# Altium schematic sheet P01_crispDemo.SchDoc
size A3
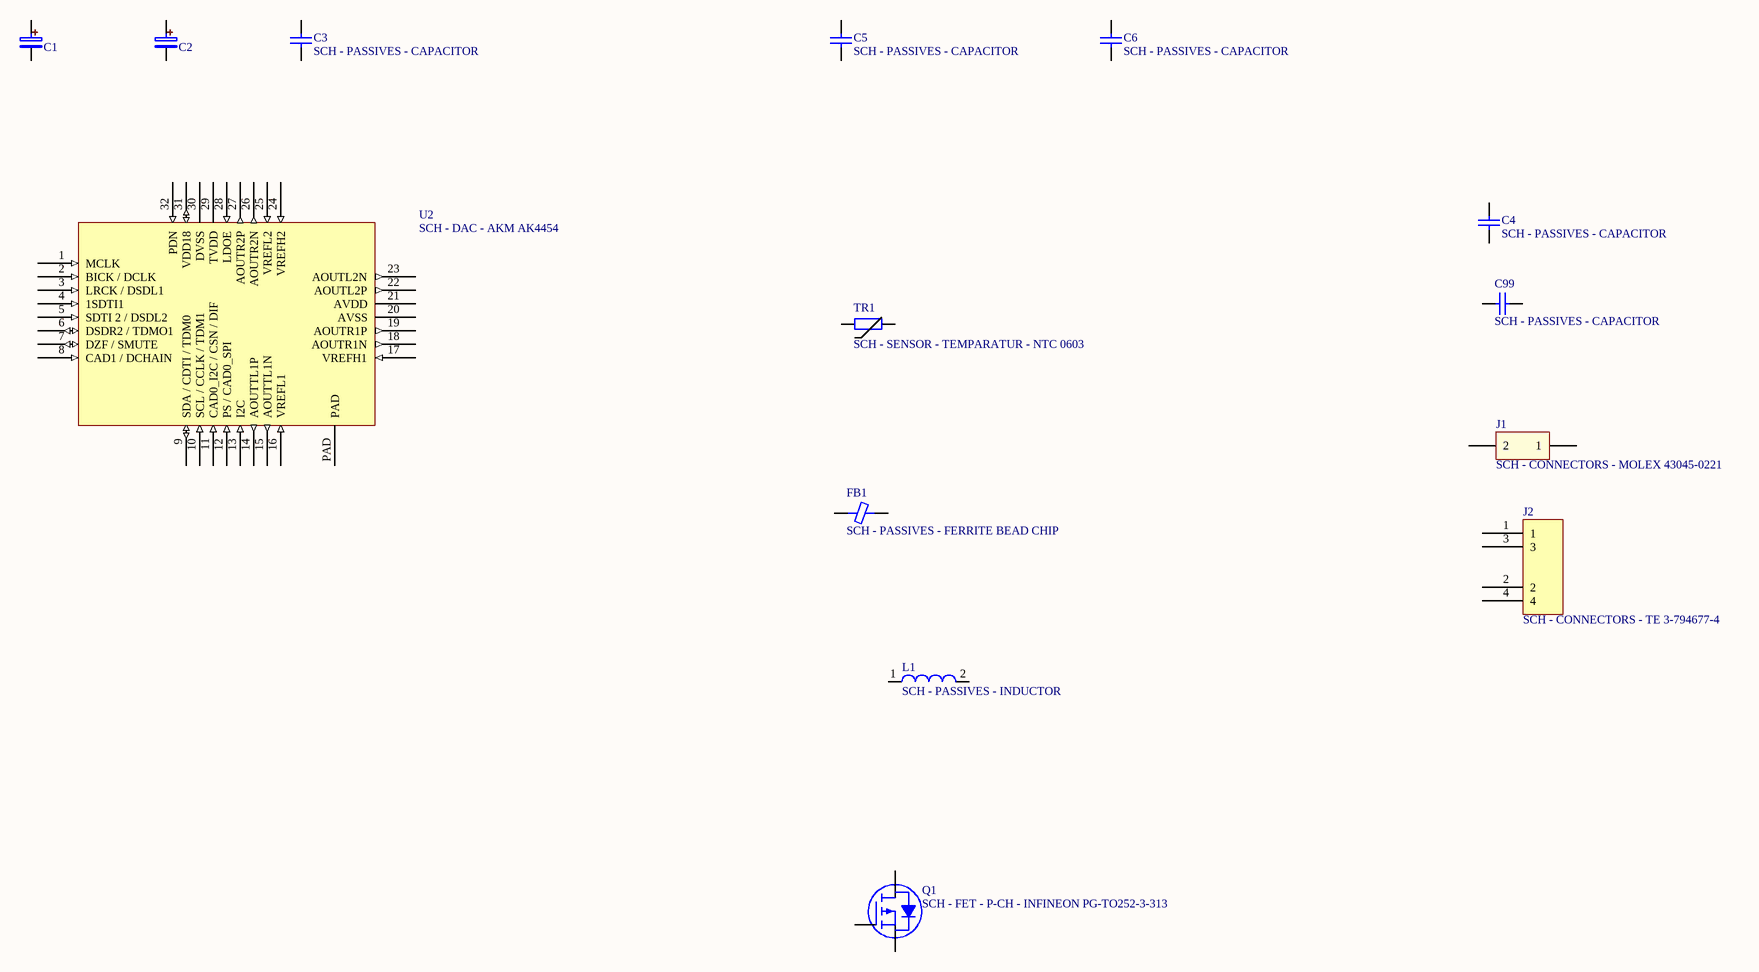
[diagram p0: P01_crispDemo.SchDoc]

## Parts
C1  SCH - PASSIVES - POLARISED CAPACITOR  [PCB - Capacitors - ELCO - Nichicon UKA1E472MHD]  (value not drawn)
C2  SCH - PASSIVES - POLARISED CAPACITOR  [PCB - Capacitors - ELCO - Nichicon UKA1E472MHD]  (value not drawn)
C3  SCH - PASSIVES - CAPACITOR  [PCB - CAPACITOR - MLCC - CAP 0402_1005]
C4  SCH - PASSIVES - CAPACITOR  [PCB - CAPACITOR - MLCC - CAP 0603_1608]
C5  SCH - PASSIVES - CAPACITOR  [PCB - CAPACITOR - MLCC - CAP 0805_2012]
C6  SCH - PASSIVES - CAPACITOR  [PCB - CAPACITOR - MLCC - CAP 1206_3216]
C99  SCH - PASSIVES - CAPACITOR  [PCB - CAPACITOR - MLCC - CAP 0603_1608]
FB1  SCH - PASSIVES - FERRITE BEAD CHIP  [PCB - Passiv - Ferrit Bead Chip - 0402]
J1  SCH - CONNECTORS - MOLEX 43045-0221  [PCB - CONNECTORS - MOLEX 43045-0221]
J2  SCH - CONNECTORS - TE 3-794677-4  [PCB - CONNECTORS - TE 3-794677-4]
L1  SCH - PASSIVES - INDUCTOR  [PCB - PASSIV - IND - WE-TPC 2828]
Q1  SCH - FET - P-CH - INFINEON PG-TO252-3-313  [PCB - Leaded - DPAK - Infineon PG-TO252-3]
TR1  SCH - SENSOR - TEMPARATUR - NTC 0603  [PCB- SENSOR - TEMPARATUR - NTC 0603]
U2  SCH - DAC - AKM AK4454  [PCB - DAC - AKM QFN32]

## Nets

Not connected (* = marked no-connect by the designer): C1 1(+) 2(-); C2 1(+) 2(-); C3 1 2; C4 1 2; C5 1 2; C6 1 2; C99 1 2; FB1 1 2; J1 1 2; J2 1 2 3 4; L1 1 2; Q1 1(G) 2(D) 3(S); TR1 1 2; U2 1(MCLK) 2(BICK_/_DCLK) 3(LRCK_/_DSDL1) 4(1SDTI1) 5(SDTI_2_/_DSDL2) 6(DSDR2_/_TDMO1) 7(DZF_/_SMUTE) 8(CAD1_/_DCHAIN) 9(SDA_/_CDTI_/_TDM0) 10(SCL_/_CCLK_/_TDM1) 11(CAD0_I2C_/_CSN_/_DIF) 12(PS_/_CAD0_SPI) 13(I2C) 14(AOUTTL1P) 15(AOUTTL1N) 16(VREFL1) 17(VREFH1) 18(AOUTR1N) 19(AOUTR1P) 20(AVSS) 21(AVDD) 22(AOUTL2P) 23(AOUTL2N) 24(VREFH2) 25(VREFL2) 26(AOUTR2N) 27(AOUTR2P) 28(LDOE) 29(TVDD) 30(DVSS) 31(VDD18) 32(PDN) PAD

## Notes on the sheet
- Title:
- Size:
- Date:
- A3
- Variant:
- Time:
- Revision:
- Sheet
- of
- File:

## Library data of the parts
C1 = EKYA630ELL152MLP1S: 1500 µF 63 V Aluminum Electrolytic Capacitors Radial, Can 10000 Hrs @ 105°C; Manufacturer: Chemi-Con; Rated Capacitance: 1500uF; Ratings: NA; Capacitance Tolerance: +-20% at 120Hz, 20°c; Rated Voltage: 63V; Ripple Current @ Low Frequency: 1.74 A @ 120 Hz; Ripple Current @ High Frequency: 2.9 A @ 100 kHz; Part Number: EKYA630ELL152MLP1S; Verified: No; Package: Radial, Can; Part Status: Active; Operating Temperature: -40°C ~ 105°C; Lifetime @ Temperature: 10000 Hrs @ 105°C; Lead Spacing: 7.50mm; Mounting Type: Through Hole; Height - Seated (Max): 36.50mm; Size / Dimension: Dia 16.00mm
C2 = UKA1E472MHD: CAP ALUM 4700UF 20% 25V RADIAL; Manufacturer: Nichicon; Ratings: AEC-Q200 compliant; Capacitance Tolerance: +-20% at 120Hz, 20°c; Lifetime @ Temperature: 2000 Hrs @ 105°C; Ripple Current @ Low Frequency: 1.71 A @ 120 Hz; Ripple Current @ High Frequency: 1.9665 A @ 10 kHz; Part Number: UKA1E472MHD; Rated Capacitance: 4700uF; Verified: No; Package: Radial, Can; Part Status: Not For New Designs; Rated Voltage: 25V; Operating Temperature: -55°C ~ 105°C; Lead Spacing: 7.50mm; Mounting Type: Through Hole; Height - Seated (Max): 33.00mm; Size / Dimension: Dia 16.00mm
C3 = CL05B104KA5NNNC: CAP CER 0.1UF 25V X7R 0402; Manufacturer: Samsung Electro-Mechanics; Ratings: NA; Tolerance: +-10%; Part Number: CL05B104KA5NNNC; Capacitance: 0.1uF; Verified: No; Package: 0402 (1005 Metric); Part Status: Active; Temperature Coefficient: X7R; Voltage - Rated: 25V; Operating Temperature: -55°C ~ 125°C; Size / Dimension: 0.039" L x 0.020" W (1.00mm x 0.50mm); Thickness (Max): 0.022" (0.55mm); Features: NA
C4 C99 = CGA3E2X7R1H104K080AE: CAP CER 0.1UF 50V X7R 0603; Manufacturer: TDK Corporation; Tolerance: +-10%; Part Number: CGA3E2X7R1H104K080AE; Capacitance: 0.1uF; Verified: No; Package: 0603 (1608 Metric); Part Status: Active; Ratings: AEC-Q200; Temperature Coefficient: X7R; Voltage - Rated: 50V; Operating Temperature: -55°C ~ 125°C; Size / Dimension: 0.063" L x 0.031" W (1.60mm x 0.80mm); Thickness (Max): 0.037" (0.95mm); Features: Soft Termination
C5 = GCJ21BR71H105KA01L: CAP CER 1UF 50V X7R 0805; Manufacturer: Murata Electronics; Tolerance: +-10%; Part Number: GCJ21BR71H105KA01L; Capacitance: 1uF; Verified: No; Package: 0805 (2012 Metric); Part Status: Active; Ratings: AEC-Q200; Temperature Coefficient: X7R; Voltage - Rated: 50V; Operating Temperature: -55°C ~ 125°C; Size / Dimension: 0.079" L x 0.049" W (2.00mm x 1.25mm); Thickness (Max): 0.057" (1.45mm); Features: Soft Termination
C6 = GCJ31CR71H225KA12K: CAP CER 2.2UF 50V X7R 1206; Manufacturer: Murata Electronics; Capacitance: 2.2 µF; Tolerance: +-10%; Part Number: GCJ31CR71H225KA12K; Verified: No; Package: 1206 (3216 Metric); Part Status: Active; Ratings: AEC-Q200; Temperature Coefficient: X7R; Voltage - Rated: 50V; Operating Temperature: -55°C ~ 125°C; Size / Dimension: 0.126" L x 0.063" W (3.20mm x 1.60mm); Thickness (Max): 0.075" (1.90mm); Features: Soft Termination
FB1 = BLM15AG221SH1D: FERRITE BEAD 220 OHM 0402 1LN; Manufacturer: Murata Electronics; Impedance @ Frequency: 220 Ohms @ 100 MHz; Current Rating (Max): 300mA; DC Resistance (DCR) (Max): 350mOhm; Part Number: BLM15AG221SH1D; Verified: No; Package: 0402 (1005 Metric); Part Status: Active; Ratings: AEC-Q200; Operating Temperature: -55°C ~ 125°C; Mounting Type: Surface Mount; Height (Max): 0.022" (0.55mm); Size / Dimension: 0.039" L x 0.022" W (1.00mm x 0.55mm); Series: EMIFIL®, BLM15
J1 = 0430450221: CONN HEADER R/A 2POS; Number of Positions: 2; Row Spacing - Mating: 0.118" (3.00mm); Style: Board to Cable/Wire; Current Rating (Amps): 8A; Voltage Rating: 600V; Series: Micro-Fit 3.0 43045; Verified: No; Connector Type: Header; Manufacturer: Molex; Part Number: 0430450221; Part Status: Active; Contact Type: Male Pin; Number of Rows: 2; Mounting Type: Through Hole, Right Angle; Termination: Solder; Fastening Type: Locking Ramp; Insulation Color: Black
J2 = 3-794677-4: CONN HEADER R/A 4POS 3MM; Manufacturer: TE Connectivity AMP Connectors; Number of Positions: 4; Row Spacing - Mating: 0.118" (3.00mm); Style: Board to Cable/Wire; Current Rating (Amps): Varies by Wire Gauge; Voltage Rating: 250V; Series: Micro MATE-N-LOK; Verified: No; Connector Type: Header; Part Number: 3-794677-4; Part Status: Active; Contact Type: Male Pin; Number of Rows: 2; Mounting Type: Through Hole, Right Angle; Termination: Solder; Fastening Type: Locking Ramp; Insulation Color: Black
L1 = 744025002: FIXED IND 2.2UH 1.8A 66 MOHM SMD; Manufacturer: Würth Elektronik; Inductance: 2.2 µH; Ratings: NA; Tolerance: ±20%; Current - Saturation (Isat): 2.4A; Shielding: Shielded; DC Resistance (DCR): 66mOhm Max; Type: Drum Core, Wirewound; Part Number: 744025002; Verified: No; Package: Nonstandard; Part Status: Active; Operating Temperature: -40°C ~ 125°C; Series: WE-TPC; Current Rating (Amps): 1.8 A; Mounting Type: Surface Mount; Size / Dimension: 0.110" L x 0.110" W (2.80mm x 2.80mm); Height - Seated (Max): 0.118" (3.00mm)
Q1 = IPD50P04P413ATMA2: MOSFET P-CH 40V 50A TO252-3; Manufacturer: Infineon Technologies; Ratings: AEC qualified; FET Type: P-Channel; Current - Continuous Drain (Id) @ 25°C: 50A (Tc); Drive Voltage (Max Rds On, Min Rds On): 10V; Rds On (Max) @ Id, Vgs: 12.6mOhm @ 50A, 10V; Vgs(th) (Max) @ Id: 4V @ 85µA; Gate Charge (Qg) (Max) @ Vgs: 51 nC @ 10 V; Vgs (Max): ±20V; Power Dissipation (Max): 58W (Tc); Part Number: IPD50P04P413ATMA2; Series: OptiMOS®-P2; Verified: No; Package: TO-252-3, DPak (2 Leads + Tab), SC-63; Part Status: Active; Technology: MOSFET (Metal Oxide); Drain to Source Voltage (Vdss): 40 V; Operating Temperature: -55°C ~ 175°C (TJ); Mounting Type: Surface Mount
TR1 = NTCS0603E3103JMT: THERMISTOR NTC 10KOHM 3610K 0603; Manufacturer: Vishay Beyschlag/Draloric/BC Components; Resistance in Ohms @ 25°C: 10k; Resistance Tolerance: ±5%; Power - Max: 125 mW; Part Number: NTCS0603E3103JMT; Verified: No; Package: 0603 (1608 Metric); Part Status: Active; Ratings: AEC-Q200; Operating Temperature: -40°C ~ 150°C; Mounting Type: Surface Mount
U2 = AK4454VN: IC DAC/AUDIO 32BIT 768K 32QFN; Manufacturer: Asahi Kasei Microdevices/AKM; Ratings: NA; Voltage - Supply: 1.7V ~ 5.5V; Part Number: AK4454VN; Type: DAC, Audio; Verified: No; Package: 32-WFQFN Exposed Pad; Part Status: Active; Operating Temperature: -40°C ~ 105°C